# EAGLE design surficial sensor (EAGLE 9.6.0)
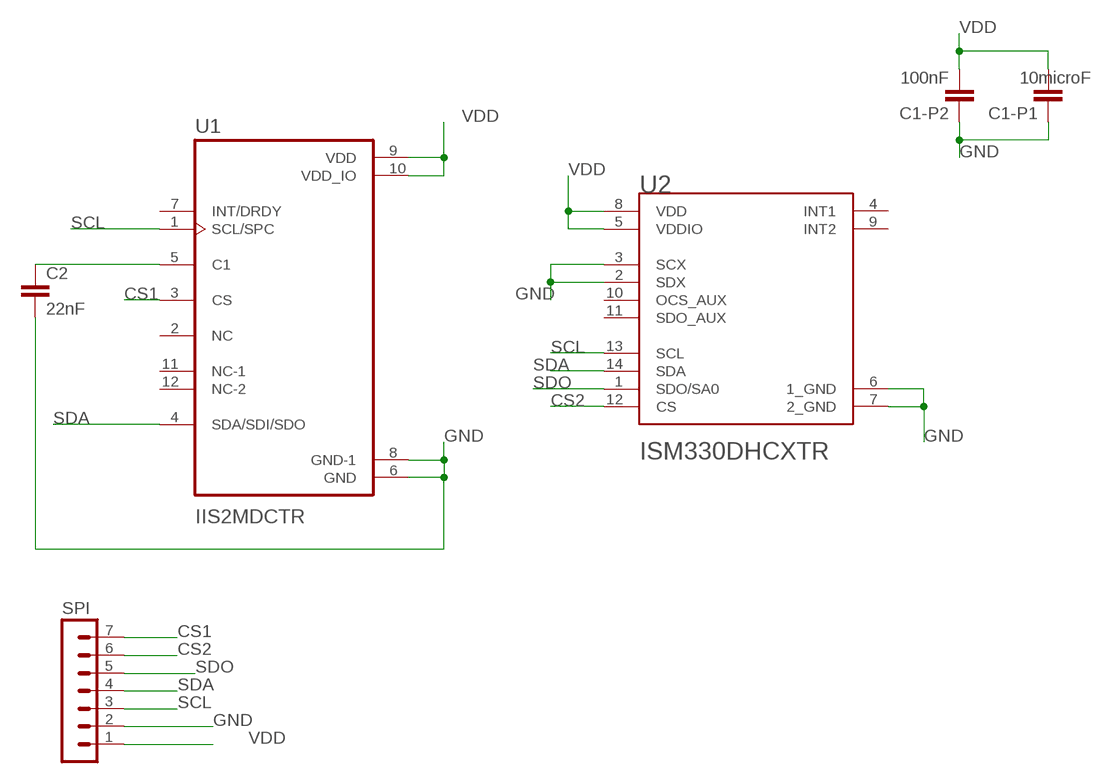
[diagram p0: schematic, sheet 1]

## Parts
C1-P1  10microF  C-EUC0603  [C0603]
C1-P2  100nF  C-EUC0603  [C0603]
C2  22nF  C-EUC0603  [C0603]
SPI  MA07-1  [MA07-1]
U1  IIS2MDCTR  [LGA12R50P4X4_200X200X70]
U2  STMICROELECTRONICS_ISM330DHCXTRSTMICROELECTRONICS_ISM330DHCXTR_0_0  [STMICROELECTRONICS_ISM330DHCXTR_0]

## Nets
CS1: SPI.7 U1.3(CS)
CS2: SPI.6 U2.12(CS)
GND: C1-P1.1 C1-P2.1 C2.2 SPI.2 U1.6(GND) U1.8(GND-1) U2.2(SDX) U2.3(SCX) U2.6(1_GND) U2.7(2_GND)
N$1: C2.1 U1.5(C1)
SCL: SPI.3 U1.1(SCL/SPC) U2.13(SCL)
SDA: SPI.4 U1.4(SDA/SDI/SDO) U2.14(SDA)
SDO: SPI.5 U2.1(SDO/SA0)
VDD: C1-P1.2 C1-P2.2 SPI.1 U1.9(VDD) U1.10(VDD_IO) U2.5(VDDIO) U2.8(VDD)
Unconnected: U1.2(NC) U1.7(INT/DRDY) U1.11(NC-1) U1.12(NC-2) U2.4(INT1) U2.9(INT2) U2.10(OCS_AUX) U2.11(SDO_AUX)

## Library data of the parts
C1-P1 C1-P2 C2 = rcl:C-EU: CAPACITOR, European symbol; SPICEPREFIX: C
SPI = con-lstb:MA07-1: PIN HEADER; OC_FARNELL: unknown; OC_NEWARK: unknown
U1 = IIS2MDCTR (1):IIS2MDCTR: None Buy Part <https://snapeda.com/parts/IIS2MDCTR/STMicroelectronics/view-part/?ref=eda>; AVAILABILITY: Good; DESCRIPTION: Magnetoresistive Sensor X, Y, Z Axis 12-LGA (2x2); DIGIKEY-PURCHASE-URL: https://snapeda.com/shop?store=DigiKey&id=2447997; MF: STMicroelectronics; MOUSER-PURCHASE-URL: https://snapeda.com/shop?store=Mouser&id=2447997; MP: IIS2MDCTR; PACKAGE: LGA-12 STMicroelectronics; PRICE: None
U2 = STMicroelectronics - ISM330DHCXTR:STMICROELECTRONICS_ISM330DHCXTR: Accelerometer, Gyroscope, Temperature, 6 Axis Sensor I²C, SPI Output; ACCEL_RANGE: 2/4/8/16g; AUTOMOTIVE: No; CENTROID_NOT_SPECIFIED: No; DATASHEET: https://www.st.com/resource/en/datasheet/ism330dhcx.pdf; DEVICE_CLASS_L1: Sensors; DEVICE_CLASS_L2: Motion Sensors; DEVICE_CLASS_L3: Inertial Measurement Units (IMUs); DIGIKEY_DESCRIPTION: INEMO INERTIAL MODULE: ALWAYS-ON; DIGIKEY_PART_NUMBER: 497-19784-1-ND; FOOTPRINT_URL: https://www.st.com/content/ccc/resource/technical/document/technical_note/73/17/9c/16/dd/96/4a/01/CD00134799.pdf/files/CD00134799.pdf/jcr:content/translations/en.CD00134799.pdf; FOOTPRINT_VARIANT_NAME_0: Recommended_Land_Pattern; GYRO_RANGE: 125/250/500/1000/2000/4000°/s; HEIGHT: 0.86mm; LEAD_FREE: Yes; MAX_SUPPLY_VOLTAGE: 3.6V; MF: STMicroelectronics; MFG_PACKAGE_IDENT: LGA-14L-DM00249496; MFG_PACKAGE_IDENT_COMPONENT_ID: 648051b55531c14c; MFG_PACKAGE_IDENT_DATE: 0; MFG_PACKAGE_IDENT_REV: 1; MIN_SUPPLY_VOLTAGE: 1.62V; MOUSER_DESCRIPTION: iNEMO inertial Sensor include 3D accelerometer & 3D gyroscope; LGA-14L package; MOUSER_PART_NUMBER: 511-ISM330DHCXTR; MPN: ISM330DHCXTR; OPERATING_SUPPLY_CURRENT: 360-1200uA; PACKAGE: LGA14; PIN_0_0_8_INSIDE_EDGE: clock; PREFIX: U; ROHS: Yes; SENSOR_OUTPUT: I2C,SPI; SENSOR_TYPE: Temperature,Accelerometer,Gyroscope; TEMPERATURE_RANGE_HIGH: +105°C; TEMPERATURE_RANGE_LOW: -40°C; VERIFICATION_VERSION: 0.0.0.3

## Board
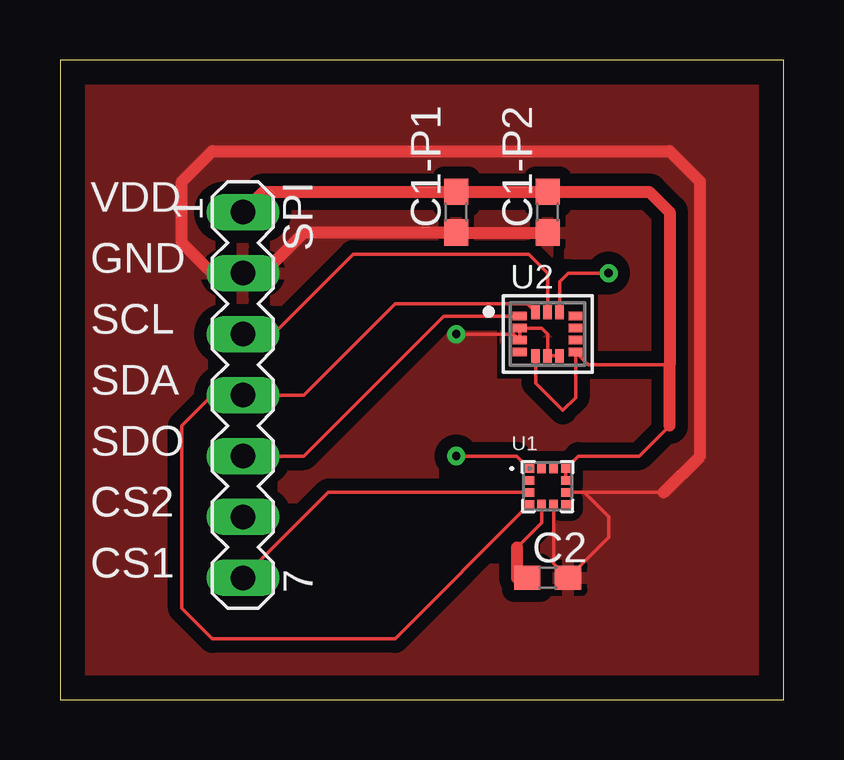
[diagram p1: board, top side]
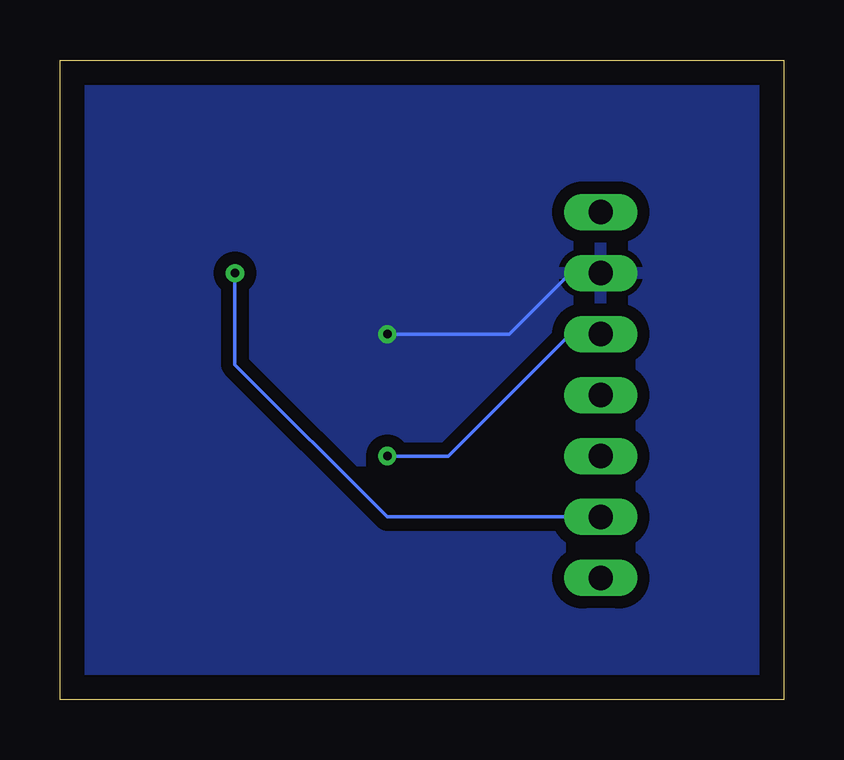
[diagram p2: board, bottom side, seen from below]

Size 30.15 x 26.66 mm. Coordinates in mm from the lower left corner, seen from the top.
Outline: 0,0 30.15,0 30.15,26.66 0,26.66 0,0
Copper layers (1*16): Top 0.035mm / dielectric 1.5mm / Bottom 0.035mm
Design rules "default *": minimum track width 6mil, minimum drill 0.35mm, track to track 20mil, track to pad 20mil, pad to pad 20mil, via to via 20mil, smd to smd 6mil, copper to edge 40mil, drill to drill 6mil, minimum pad ring 10mil, minimum via ring 8mil, stop-mask expansion 4mil, vias tented up to drill 0mil, thermal gap 10mil

### Footprints (pad centres in the part's own frame; a part is rotated, then mirrored left to right if it is on the bottom)
C0603 = smd 1.1 x 1: 1 -0.85,0; 2 0.85,0
MA07-1 = drill 1.016 long: 1 -7.62,0; 2 -5.08,0; 3 -2.54,0; 4 0,0; 5 2.54,0; 6 5.08,0; 7 7.62,0
LGA12R50P4X4_200X200X70 = smd 0.4 x 0.35: 1 -0.76,0.75; 2 -0.76,0.25; 3 -0.76,-0.25; 4 -0.76,-0.75; 7 0.76,-0.75; 8 0.76,-0.25; 9 0.76,0.25; 10 0.76,0.75 | smd 0.35 x 0.4: 5 -0.25,-0.76; 6 0.25,-0.76; 11 0.25,0.76; 12 -0.25,0.76
STMICROELECTRONICS_ISM330DHCXTR_0 = smd 0.575 x 0.35: 1 -1.162,0.75; 2 -1.162,0.25; 3 -1.162,-0.25; 4 -1.162,-0.75; 8 1.162,-0.75; 9 1.162,-0.25; 10 1.162,0.25; 11 1.162,0.75 | smd 0.35 x 0.575: 5 -0.5,-0.912; 6 0,-0.912; 7 0.5,-0.912; 12 0.5,0.912; 13 0,0.912; 14 -0.5,0.912 | smd 0.529 x 0.304: SMD_15 -1.162,0.75; SMD_16 -1.162,0.25; SMD_17 -1.162,-0.25; SMD_18 -1.162,-0.75; SMD_19 1.162,-0.75; SMD_20 1.162,-0.25; SMD_21 1.162,0.25; SMD_22 1.162,0.75 | smd 0.304 x 0.529: SMD_23 -0.5,-0.912; SMD_24 0,-0.912; SMD_25 0.5,-0.912; SMD_26 0.5,0.912; SMD_27 0,0.912; SMD_28 -0.5,0.912

### Placement (x,y rotation side)
C1-P1  16.51,20.32 90 top
C1-P2  20.32,20.32 90 top
C2  20.32,5.08 0 top
SPI  7.62,12.7 270 top
U1  20.32,8.89 0 top
U2  20.32,15.24 0 top

### Tracks (layer width: path | path; a pad name or v marks a point on that pad's centre or on a via)
CS1
  Top 0.152: SPI.7 11.18,8.64 U1.3
CS2  (via drill 0.35)
  Top 0.152: U2.12 20.82,17.42 21.18,17.78 v22.86,17.78
  Bottom 0.152: v22.86,17.78 22.86,13.97 16.51,7.62 SPI.6
GND  (via drill 0.35)
  Top 0.152: U1.6 20.57,5.68 C2.2 22.86,6.77 22.86,7.62 21.84,8.64 | 21.84,8.64 U1.8 | U2.7 U2.6 20.32,15.24 20.07,15.49 U2.2 U2.3 18.91,15.24 v16.51,15.24 | 21.84,8.64 25.15,8.64
  Top 0.508: C1-P2.1 C1-P1.1 10.16,19.47 8.47,17.78 SPI.2 6.35,17.78 5.08,19.05 5.08,21.59 6.35,22.86 25.4,22.86 26.67,21.59 26.67,10.16 25.15,8.64
  Bottom 0.152: v16.51,15.24 11.43,15.24 8.89,17.78 SPI.2
  pour Top: 0,26.67 30.48,26.67 30.48,0 0,0
  pour Bottom: 0,26.67 30.48,26.67 30.48,0 0,0
N$1
  Top 0.152: U1.5 20.07,7.37 19.05,6.35
  Top 0.508: C2.1 19.05,5.08 19.05,6.35
SCL  (via drill 0.35)
  Top 0.152: SPI.3 8.89,15.24 12.22,18.57 19.53,18.57 20.32,17.78 U2.13 | U1.1 19.04,10.16 v16.51,10.16
  Bottom 0.152: v16.51,10.16 13.97,10.16 8.89,15.24 SPI.3
SDA
  Top 0.152: U2.14 19.46,16.51 13.97,16.51 10.16,12.7 SPI.4 6.35,12.7 5.08,11.43 5.08,3.81 6.35,2.54 13.96,2.54 U1.4
SDO
  Top 0.152: SPI.5 10.16,10.16 15.99,15.99 U2.1
VDD
  Top 0.152: 25.4,13.97 22,13.97 U2.8 21.48,12.59 20.95,12.06 19.82,13.2 U2.5 | U1.9 U1.10 21.6,10.16 24.13,10.16 25.4,11.43
  Top 0.508: SPI.1 8.47,21.17 C1-P1.2 C1-P2.2 24.55,21.17 25.4,20.32 25.4,13.97 25.4,11.43

### Text on the board
tNames: VDD | GND | SCL | SDA | SDO | CS2 | CS1